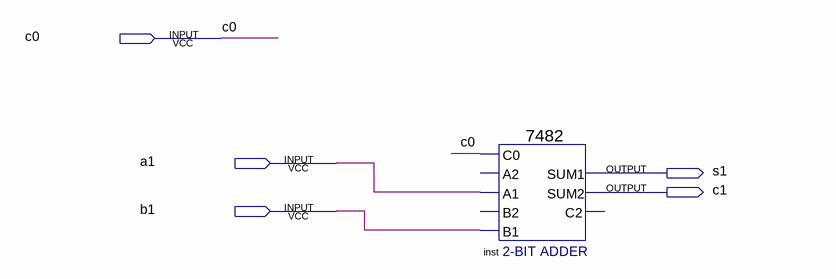
[diagram p0: schematic sheet]
// Quartus schematic FA.bdf as structural Verilog: 1 symbols, 5 pins
module FA (
  input  c0,
  input  a1,
  input  b1,
  output s1,
  output c1
);

  \7482  inst (.B1(b1), .C0(c0), .A1(a1), .SUM1(s1), .SUM2(c1));  // open: A2, B2, C2
endmodule
